# Altium schematic sheet SThuMb32.SchDoc
size A4
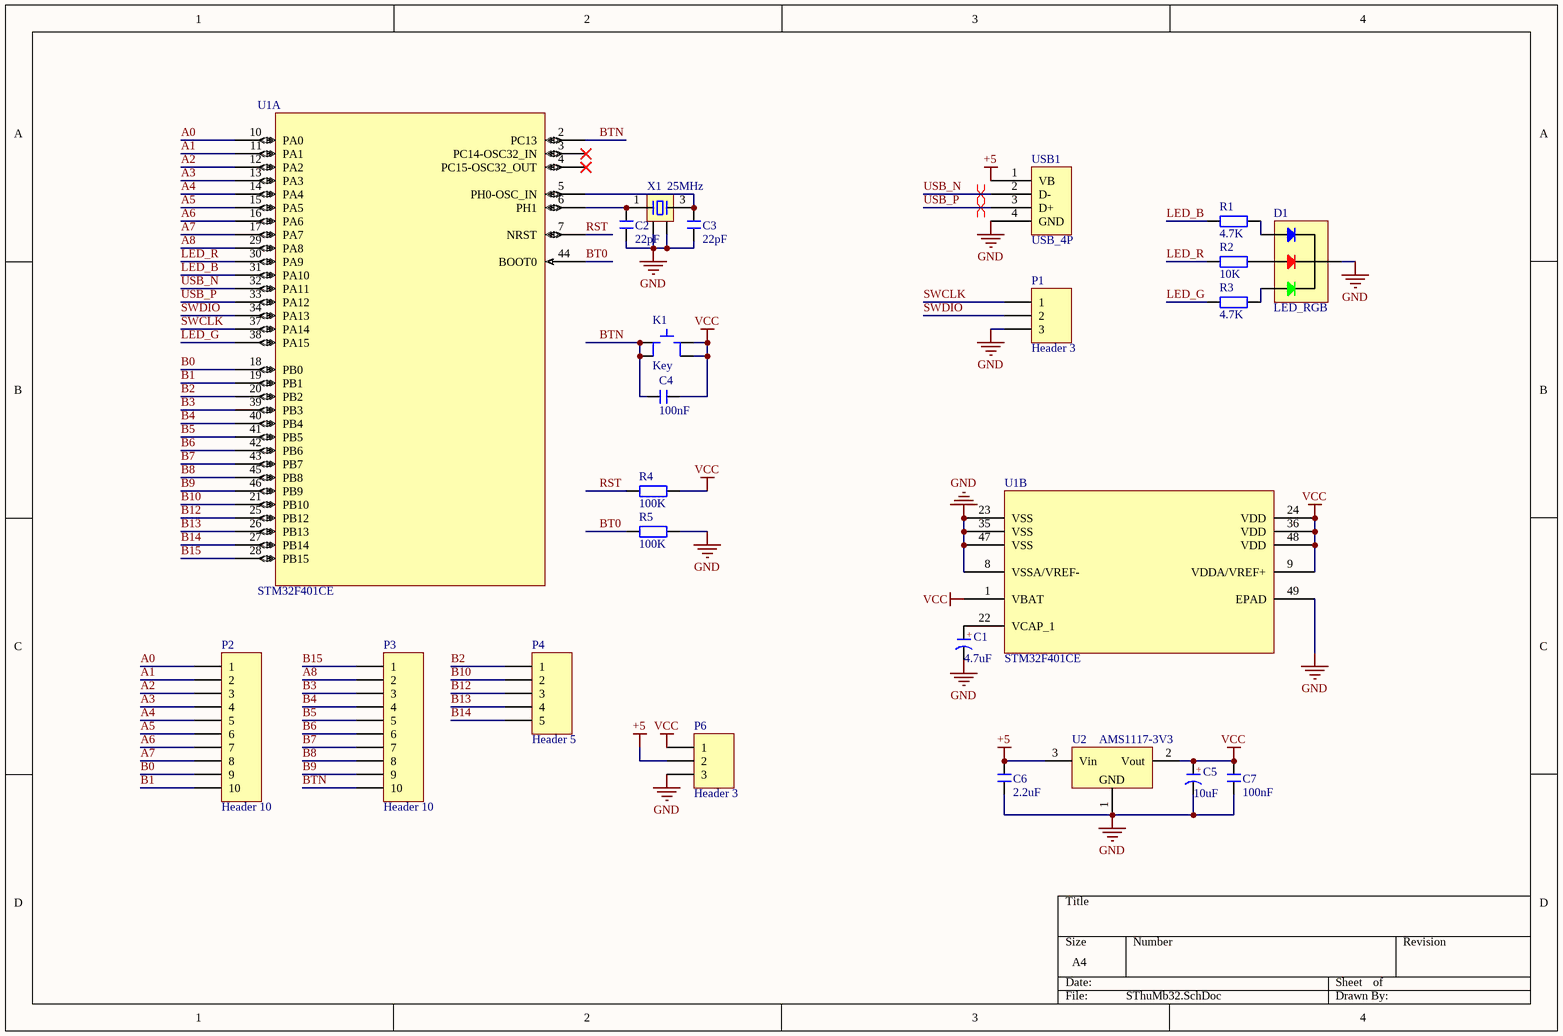
[diagram p0: SThuMb32.SchDoc]

## Parts
C1  4.7uF  [CD A(3216)]
C2  22pF  [C 0603_L]
C3  22pF  [C 0603_L]
C4  100nF  [C 0603_L]
C5  10uF  [CD A(3216)]
C6  2.2uF  [C 0603_L]
C7  100nF  [C 0603_L]
D1  LED_RGB  [LED_RGB_0606]
K1  Key  [Key_4x4_4P]
P1  Header 3  [HDR1X3]
P2  Header 10  [HDR1X10]
P3  Header 10  [HDR1X10]
P4  Header 5  [HDR1X5]
P6  Header 3  [HDR1X3]
R1  4.7K  [R 0603_L]
R2  10K  [R 0603_L]
R3  4.7K  [R 0603_L]
R4  100K  [R 0603_L]
R5  100K  [R 0603_L]
U1  STM32F401CE  [UFQFPN-48_7X7_L]  (parts A,B of 2)
U2  AMS1117-3V3  [SOT223_L]
USB1  USB_4P  [USB_A_Male]
X1  25MHz  [OSC 3225-4P]

## Nets
+5: C6.2 P6.2 U2.3(Vin) USB1.1(VB)
GND: C1.2(K) C2.1 C3.1 C5.2(K) C6.1 C7.1 D1.1(COM) P1.3 P6.3 R5.2 U1.8(VSSA/VREF-) U1.23(VSS) U1.35(VSS) U1.47(VSS) U1.49(EPAD) U2.1(GND) USB1.4(GND) X1.2 X1.4
VCC: C4.2 C5.1(A) C7.2 K1.2 K1.4 P6.1 R4.2 U1.1(VBAT) U1.9(VDDA/VREF+) U1.24(VDD) U1.36(VDD) U1.48(VDD) U2.2(Vout)
A0: P2.1 U1.10(PA0)
A1: P2.2 U1.11(PA1)
A2: P2.3 U1.12(PA2)
A3: P2.4 U1.13(PA3)
A4: P2.5 U1.14(PA4)
A5: P2.6 U1.15(PA5)
A6: P2.7 U1.16(PA6)
A7: P2.8 U1.17(PA7)
A8: P3.2 U1.29(PA8)
B0: P2.9 U1.18(PB0)
B1: P2.10 U1.19(PB1)
B2: P4.1 U1.20(PB2)
B3: P3.3 U1.39(PB3)
B4: P3.4 U1.40(PB4)
B5: P3.5 U1.41(PB5)
B6: P3.6 U1.42(PB6)
B7: P3.7 U1.43(PB7)
B8: P3.8 U1.45(PB8)
B9: P3.9 U1.46(PB9)
B10: P4.2 U1.21(PB10)
B12: P4.3 U1.25(PB12)
B13: P4.4 U1.26(PB13)
B14: P4.5 U1.27(PB14)
B15: P3.1 U1.28(PB15)
BT0: R5.1 U1.44(BOOT0)
BTN: C4.1 K1.1 K1.3 P3.10 U1.2(PC13)
LED_B: R1.1 U1.31(PA10)
LED_G: R3.1 U1.38(PA15)
LED_R: R2.1 U1.30(PA9)
RST: R4.1 U1.7(NRST)
SWCLK: P1.1 U1.37(PA14)
SWDIO: P1.2 U1.34(PA13)
USB_N: U1.32(PA11) USB1.2(D-)
USB_P: U1.33(PA12) USB1.3(D+)
NetC1_1: C1.1(A) U1.22(VCAP_1)
NetC2_2: C2.2 U1.6(PH1) X1.1
NetC3_2: C3.2 U1.5(PH0-OSC_IN) X1.3
NetD1_2: D1.2(R) R2.2
NetD1_3: D1.3(G) R3.2
NetD1_4: D1.4(B) R1.2

Not connected (* = marked no-connect by the designer): U1 3(PC14-OSC32_IN)* 4(PC15-OSC32_OUT)*

## Layout directives
differential pair: USB_N, USB_P

## Notes on the sheet
- (in symbol CT) +

## Library data of the parts
C1 C5 = CT: 贴片钽电容; 淘宝ID: 封装库来自淘宝 ID：黄晶宝石; BOM名称: 贴片钽电容; 联系售后: https://shop463601444.taobao.com
C2-C4 C6 C7 = C: 贴片电容; BOM名称: 无极性贴片电容; 淘宝ID: 封装库来自淘宝 ID：黄晶宝石; 联系售后，技术支持: https://shop463601444.taobao.com; 唯一出售店铺网址: https://shop463601444.taobao.com
D1 = LED_RGB: RGB共阴LED
K1 = Key_4P
P1 P6 = Header 3: Header, 3-Pin; LatestRevisionDate: 17-Jul-2002; LatestRevisionNote: Re-released for DXP Platform.; Publisher: Altium Limited
P2 P3 = Header 10: Header, 10-Pin; LatestRevisionDate: 17-Jul-2002; LatestRevisionNote: Re-released for DXP Platform.; Publisher: Altium Limited
P4 = Header 5: Header, 5-Pin; LatestRevisionDate: 17-Jul-2002; LatestRevisionNote: Re-released for DXP Platform.; Publisher: Altium Limited
R1-R5 = R: 贴片电阻; 版权归属: 来自淘宝 ID：黄晶宝石; 封装库来自淘宝卖家 ID：黄晶宝石: 其他店铺购入均为盗版，不享受售后技术支持服务，请立即申请退款; BOM名称: 贴片电阻; 联系售后: https://shop463601444.taobao.com
U1 = STM32F401CE: 带DSP和FPU的高性能基本型系列ARM Cortex-M4 MCU，具有512 KB Flash、84 MHz CPU和ART加速器; Manufacturer_Part_Number: stm32f4xxc1; Vendor: STMicroelectronics; Copyright: Copyright (C) 2016 Accelerated Designs. All rights reserved; RefDes: RefDes; Type: DEV; Value: Value
U2 = AMS1117: 三端稳压芯片; BOM名称: 稳压芯片; 淘宝ID: 封装库来自淘宝 ID：黄晶宝石; 欢迎光临淘宝店铺: https://shop463601444.taobao.com
X1 = XTAL-4P: 4脚无源晶振; 版权归属: 封装库来自淘宝卖家 ID：黄晶宝石; BOM名称: 4脚无源晶振; 学习资源: https://shop463601444.taobao.com